# Altium schematic sheet USB调压器.SchDoc
size A4; DocumentNumber: 1; SheetNumber: 1; SheetTotal: 8
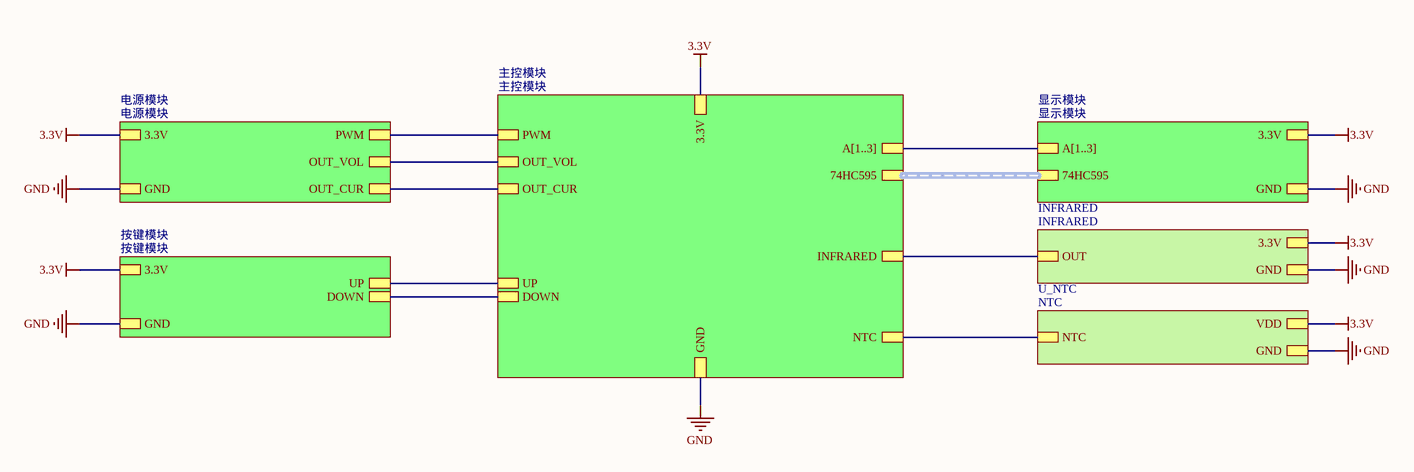
[diagram p0: USB调压器.SchDoc]

## Sub-sheets
INFRARED = INFRARED: OUT, 3.3V, GND
U_NTC = NTC: NTC, VDD, GND
主控模块 = 主控模块: A[1..3], 74HC595 (harness 74HC595), INFRARED, PWM, OUT_VOL, OUT_CUR, UP, DOWN, NTC, GND, 3.3V
按键模块 = 按键模块: DOWN, GND, UP, 3.3V
显示模块 = 显示模块: 74HC595 (harness 74HC595), GND, 3.3V, A[1..3]
电源模块 = 电源模块: GND, PWM, 3.3V, OUT_VOL, OUT_CUR

## Nets
3.3V: sheet 电源模块/3.3V, sheet 主控模块/3.3V, sheet 显示模块/3.3V, sheet 按键模块/3.3V, sheet INFRARED/3.3V, sheet U_NTC/VDD
GND: sheet 电源模块/GND, sheet 主控模块/GND, sheet 显示模块/GND, sheet 按键模块/GND, sheet INFRARED/GND, sheet U_NTC/GND
(unnamed): sheet 电源模块/PWM, sheet 主控模块/PWM
(unnamed): sheet 电源模块/OUT_VOL, sheet 主控模块/OUT_VOL
(unnamed): sheet 电源模块/OUT_CUR, sheet 主控模块/OUT_CUR
(unnamed): sheet 主控模块/INFRARED, sheet INFRARED/OUT
(unnamed): sheet 主控模块/UP, sheet 按键模块/UP
(unnamed): sheet 主控模块/DOWN, sheet 按键模块/DOWN
(unnamed): sheet 主控模块/NTC, sheet U_NTC/NTC

## Buses and harness runs
bus sheet 主控模块/A[1..3] = sheet 显示模块/A[1..3]
harness sheet 主控模块/74HC595 = sheet 显示模块/74HC595